# Altium schematic sheet 6-Accelerometer.SchDoc
size A4
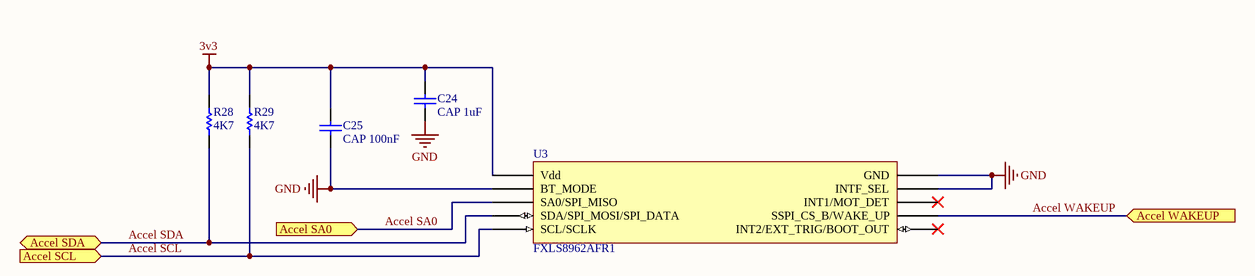
[diagram p0: 6-Accelerometer.SchDoc]

## Parts
C24  CAP 1uF  [CAPC0603(1608)100_N]
C25  CAP 100nF  [CAPC0603(1608)100_N]
R28  4K7  [RESC0603(1608)_N]
R29  4K7  [RESC0603(1608)_N]
U3  FXLS8962AFR1  [FXLS8962AFR1]

## Ports
Accel SA0 (in), Accel SCL (in), Accel SDA (bidir), Accel WAKEUP (in)

## Nets
3v3: C24.2 C25.2 R28.2 R29.2 U3.1(Vdd)
GND: C24.1 C25.1 U3.2(BT_MODE) U3.9(INTF_SEL) U3.10(GND)
Accel SA0: U3.3(SA0/SPI_MISO) ; port Accel SA0
Accel SCL: R29.1 U3.5(SCL/SCLK) ; port Accel SCL
Accel SDA: R28.1 U3.4(SDA/SPI_MOSI/SPI_DATA) ; port Accel SDA
Accel WAKEUP: U3.7(SSPI_CS_B/WAKE_UP) ; port Accel WAKEUP

Not connected (* = marked no-connect by the designer): U3 6(INT2/EXT_TRIG/BOOT_OUT)* 8(INT1/MOT_DET)*

## Library data of the parts
C24 = CMP-1035-02736-1: CAP 1uF 16V ±5% 0603 (1608 Metric) Thickness 1mm SMD; Case-Metric: 1608; Case-EIA: 0603; Tolerance: Â±5%; Technology: SMT; Max Thickness: 1 mm; Rated Voltage: 16 V; Value: 1uF
C25 = CMP-1035-02589-1: CAP 100nF 25V ±20% 0603 (1608 Metric) Thickness 1mm SMD; Case-EIA: 0603; Tolerance: Â±20%; Case-Metric: 1608; Value: 100nF; Max Thickness: 1 mm; Technology: SMT; Rated Voltage: 25 V
R28 = CMP-1012-00090-1: Tolerance: 5 %; Case-Metric: 1608; Power: 0.1 W; Value: 4700.00 Ohm; Case-EIA: 0603; Technology: SMT
R29 = CMP-1012-00090-1: 4K7 5% 0603(1608); Case-Metric: 1608; Power: 0.1 W; Value: 4700.00 Ohm; Case-EIA: 0603; Tolerance: 5 %; Technology: SMT
U3 = FXLS8962AFR1: 3 axis accelerometer